# Altium schematic sheet Gas_leakage.SchDoc
size A; SheetNumber: 1; SheetTotal: 1
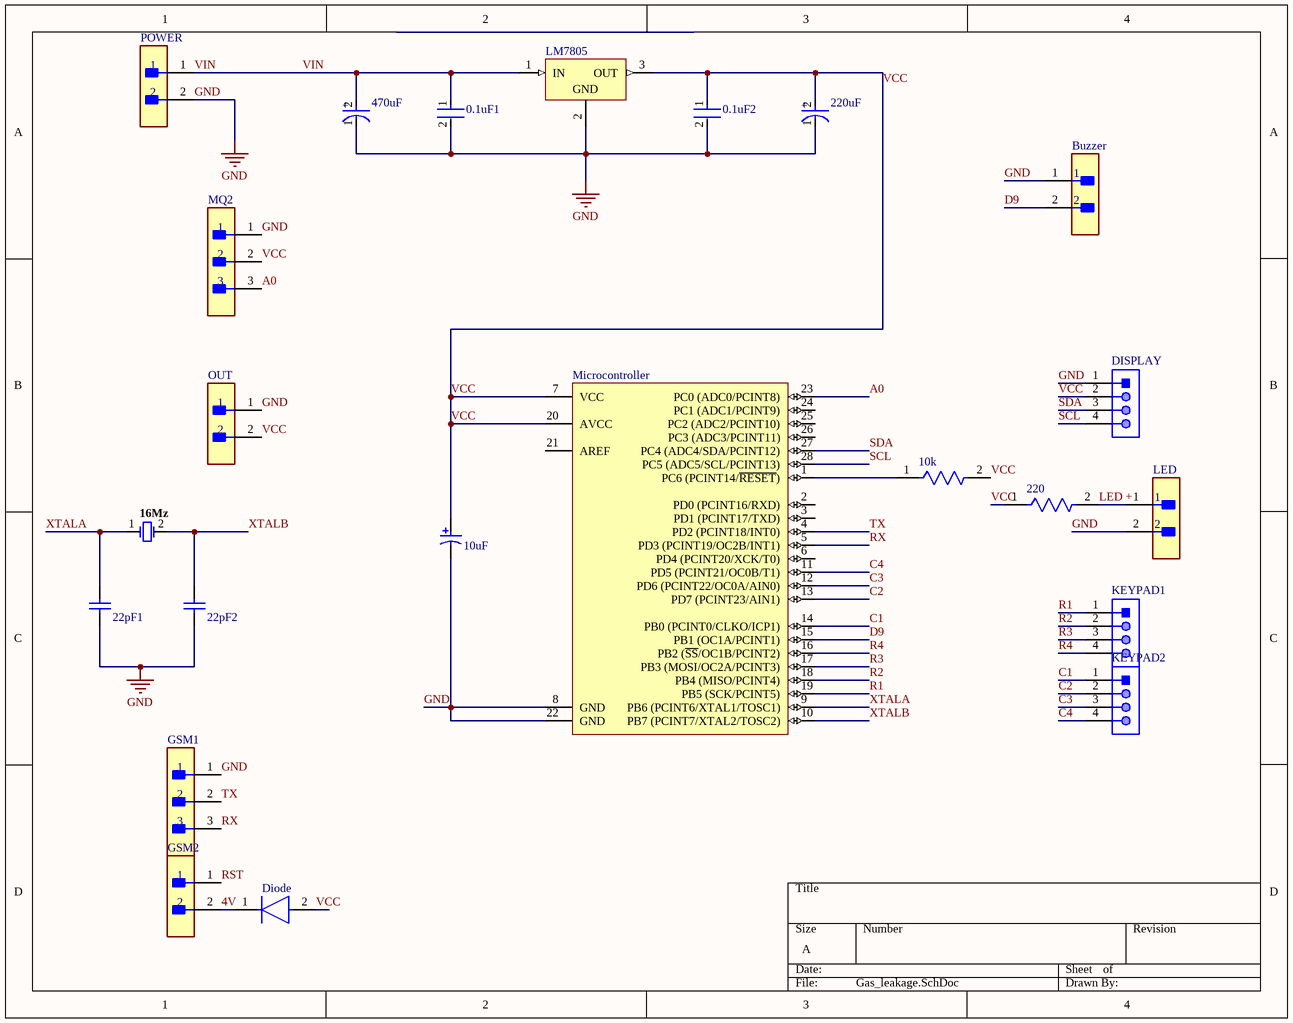
[diagram p0: Gas_leakage.SchDoc]

## Parts
0.1uF1  SR205C104KAR  [FP-SR20-MFG]  (value not drawn)
0.1uF2  SR205C104KAR  [FP-SR20-MFG]  (value not drawn)
10k  CF18JT10K0  [FP-CF18-MFG]  (value not drawn)
10uF  ECA1HM100  [CAPPR55-200-1100X500X1200]  (value not drawn)
16Mz  FOXSLF/160-20  [FOX-FOXSLF160-20]  (value not drawn)
22pF1  C315C220K1G5TA  [KEMT-C315-THT-2]  (value not drawn)
22pF2  C315C220K1G5TA  [KEMT-C315-THT-2]  (value not drawn)
220  CMF55205R00FHEB  [FP-CMF55-MFG]  (value not drawn)
220uF  EEUFM1A221  [FP-RAD-TH-D_6_3_0_5-L_11-MFG]  (value not drawn)
470uF  EEUHD1E471  [FP-RAD-TH-D_10_0_5-L_12_5-MFG]  (value not drawn)
Buzzer  M20-9990246  [FP-M20-9990246-MFG]  (value not drawn)
Diode  1N5408G-T  [FP-DO-201AD-MFG]  (value not drawn)
DISPLAY  61300411121  [61300411121]  (value not drawn)
GSM1  90120-0763  [FP-90120-0763-MFG]  (value not drawn)
GSM2  M20-9990246  [FP-M20-9990246-MFG]  (value not drawn)
KEYPAD1  1300411121  [61300411121]  (value not drawn)
KEYPAD2  61300411121  [61300411121]  (value not drawn)
LED  M20-9990246  [FP-M20-9990246-MFG]  (value not drawn)
LM7805  LM7805CT  [FAIR-TO-220-3]  (value not drawn)
Microcontroller  ATmega328P-PU  [28P3]  (value not drawn)
MQ2  90120-0763  [FP-90120-0763-MFG]  (value not drawn)
OUT  M20-9990246  [FP-M20-9990246-MFG]  (value not drawn)
POWER  M20-9990246  [FP-M20-9990246-MFG]  (value not drawn)

## Nets
GND: 0.1uF1.2 0.1uF2.2 10uF.2 22pF1.1 22pF2.1 220uF.1(C) 470uF.1(C) Buzzer.1 DISPLAY.1 GSM1.1 LED.2 LM7805.2(GND) Microcontroller.8(GND) Microcontroller.22(GND) MQ2.1 OUT.1 POWER.2
4V: Diode.1(C) GSM2.2
A0: Microcontroller.23(PC0_(ADC0/PCINT8)) MQ2.3
C1: KEYPAD2.1 Microcontroller.14(PB0_(PCINT0/CLKO/ICP1))
C2: KEYPAD2.2 Microcontroller.13(PD7_(PCINT23/AIN1))
C3: KEYPAD2.3 Microcontroller.12(PD6_(PCINT22/OC0A/AIN0))
C4: KEYPAD2.4 Microcontroller.11(PD5_(PCINT21/OC0B/T1))
D9: Buzzer.2 Microcontroller.15(PB1_(OC1A/PCINT1))
LED +: 220.2 LED.1
R1: KEYPAD1.1 Microcontroller.19(PB5_(SCK/PCINT5))
R2: KEYPAD1.2 Microcontroller.18(PB4_(MISO/PCINT4))
R3: KEYPAD1.3 Microcontroller.17(PB3_(MOSI/OC2A/PCINT3))
R4: KEYPAD1.4 Microcontroller.16(PB2_(~{SS}/OC1B/PCINT2))
RST: GSM2.1
RX: GSM1.3 Microcontroller.5(PD3_(PCINT19/OC2B/INT1))
SCL: DISPLAY.4 Microcontroller.28(PC5_(ADC5/SCL/PCINT13))
SDA: DISPLAY.3 Microcontroller.27(PC4_(ADC4/SDA/PCINT12))
TX: GSM1.2 Microcontroller.4(PD2_(PCINT18/INT0))
VCC: 0.1uF2.1 10k.2 10uF.1 220.1 220uF.2(A) Diode.2(A) DISPLAY.2 LM7805.3(OUT) Microcontroller.7(VCC) Microcontroller.20(AVCC) MQ2.2 OUT.2
VIN: 0.1uF1.1 470uF.2(A) LM7805.1(IN) POWER.1
XTALA: 16Mz.1 22pF1.2 Microcontroller.9(PB6_(PCINT6/XTAL1/TOSC1))
XTALB: 16Mz.2 22pF2.2 Microcontroller.10(PB7_(PCINT7/XTAL2/TOSC2))
Net10k_1: 10k.1 Microcontroller.1(PC6_(PCINT14/~{RESET}))

Not connected (* = marked no-connect by the designer): Microcontroller 2(PD0_(PCINT16/RXD)) 3(PD1_(PCINT17/TXD)) 6(PD4_(PCINT20/XCK/T0)) 21(AREF) 24(PC1_(ADC1/PCINT9)) 25(PC2_(ADC2/PCINT10)) 26(PC3_(ADC3/PCINT11))

## Notes on the sheet
- (in symbol CMP-05427-001329-1) +
- (in symbol CMP-05427-001388-1) +

## Library data of the parts
0.1uF1 0.1uF2 = CMP-04427-000013-1: CAP CER 0.1UF 50V X7R RADIAL; Manufacturer: AVX; Tolerance: 10%; Capacitance: 100nF; Value: 100nF; Voltage: 50V; Material: Ceramic; Height: 5.08mm; Digikey Description: CAP CER 0.1UF 50V X7R RADIAL; Device Class L2: Capacitors; ComponentLink2URL: http://datasheets.avx.com/SR-Series.pdf; Temperature Range High: +125°C; Lead Free: Yes; Manufacturer Part Number: SR205C104KAR; Category: Cap; Device Class L1: Passive Components; Temperature: -55°C to +125°C; Voltage Rating: 50V; ComponentLink2Description: Datasheet; RoHS: TRUE; Automotive: No; Octopart: https://octopart.com/sr205c104kar-avx-145048; Mouser Description: Multilayer Ceramic Capacitors MLCC - Leaded 50volts 0.1uF 10% X7R; Temperature Characteristic: X7R; Device Class L3: Ceramic Capacitors; Temperature Range Low: -55°C; Package: SR20
10k = CMP-26528-000002-1: RES 10K OHM 1/8W 5% CF AXIAL; Manufacturer: Stackpole Electronics; Power Rating: 0.125W; Temperature Coefficient: 0-500ppm/°C; Resistance: 10kΩ; Voltage Rating: 250V; Value: 10kΩ; Temperature: -55°C to +155°C; Height: 2mm; Lead Free: Yes; Automotive: No; Device Class L2: Resistors; Package: CF18; Series: CF; ComponentLink2Description: Datasheet; Ipc Land Pattern Name: RESAD656W65L360D200; Manufacturer Part Number: CF18JT10K0; Temperature Range High: +155°C; RoHS: TRUE; Device Class L3: Through-Hole Resistors; Temperature Range Low: -55°C; Device Class L1: Passive Components; Category: Res; Octopart: https://octopart.com/cf18jt10k0-stackpole+electronics-19205642; Composition: Carbon Film; Digikey Description: RES 10K OHM 1/8W 5% CF AXIAL; ComponentLink2URL: http://www.seielect.com/Catalog/SEI-CF_CFM.pdf; Tolerance: 5%
10uF = CMP-1665-00038-2: Aluminum Electrolytic Capacitor, 10 uF, +/- 20%, 50 V, -40 to 85 degC, 2-Pin THD, RoHS, Bulk; Manufacturer: Panasonic; Life (Hours): 2000Hour; Lead/Base Style: Straight; Dissipation Factor: 0.12%; Capacitance: 10uF; Leakage Current: 3uA; Dielectric Material: Aluminium; Lead Diameter: 0.5mm; Voltage Rating: 50V; Ripple Current: 65mA; Package Reference: CAPPR55-200-1100X500X1200; Height: 11mm; Diameter: 5mm; REACH SVHC: NoSVHC; Mount: ThroughHole; Packaging: Bulk; Manufacturer URL: http://www.panasonic.com/; Termination: Radial; Datasheet URL: https://industrial.panasonic.com/cdbs/www-data/pdf/RDF0000/ABA0000C1218.pdf; Lead Free: LeadFree; Height - Seated (Max): 0.472inch; Case/Package: Radial; Package Description: 2-Pin Radial Lead, Dia 5 mm, Height 12 mm; Tolerance: 20%; Datasheet Version: Rev. 05, 10/2016; Package Quantity: 200; Ripple Current (AC): 65mA; Min Operating Temperature: -40degC; RoHSCompliant: true; Number of Pins: 2; Max Operating Temperature: 85degC; Voltage: 50V; Lead Pitch: 2mm; Radiation Hardening: No; Voltage Rating (DC): 50V; Length: 11mm
16Mz = CMP-1749-00003-1: Resistance Weld Thru-Hole Crystal, 16 MHz, -20 to 70 degC, 2-Pin THD, RoHS, Bulk; Voltage Rating: 250 V; Tolerance: 1%; Resistance: 221 kohm; Case\Package: Axial; Power Rating: 250 mW; RoHSCompliant: true; Package Quantity: 200; Packaging: Bulk; Min Operating Temperature: -55 degC; DatasheetVersion: Mar-15; ComponentLink1URL: http://www.foxonline.com/; Max Operating Temperature: 155 degC; PackageReference: FOXSLF160-20; Mount: Through Hole; PackageDescription: 2-Pin Through Hole Device, Body 11.35 x 4.65 mm; ComponentLink1Description: Manufacturer URL; ComponentLink2URL: http://www.foxonline.com/pdfs/hc49slf.pdf; ComponentLink2Description: Datasheet; Length: 0.248 inch
22pF1 22pF2 = CMP-1664-00008-1: Capacitor, Ceramic, 22 pF, +/-10 %, 100 V, -55 to 125 degC, 2-Pin THD, RoHS, Bulk; Max Input Voltage: 40 V; Min Input Voltage: 4.2 V; Output Current: 1.5 A; Output Voltage: 1.2 V; Outputs: 1; Case\Package: TO-220; RoHSCompliant: true; Min Operating Temperature: 0 degC; Max Operating Temperature: 125 degC; Package Quantity: 50; ComponentLink2URL: http://capacitoredge.kemet.com/capedge2/DataSheet/Datasheet-C315C220K1G5TA.pdf?pn=C315C220K1G5TA{BULK}; Radiation Hardening: No; Pins: 3; Length: 10.28 mm; ComponentLink1URL: http://www.kemet.com/; ComponentLink2Description: Datasheet; Height: 9.28 mm; REACH SVHC: No SVHC; ComponentLink1Description: Manufacturer URL; Max Ouput Current: 1.5 A; Weight: 0.08113 oz; Packaging: Rail/Tube; DatasheetVersion: Aug-16; Mount: Through Hole; PackageReference: C315-THT-2; Width: 4.82 mm; PackageDescription: 2-Pin Through Hole Device, Body 3.81 x 2.54 mm
220 = CMP-02408-000020-1: RES 220 OHM 1/2W 1% AXIAL; Voltage Rating (DC): 250V; Max Power Dissipation: 500mW; Temperature Coefficient: 50ppm/°C; Resistance: 220; Diameter: 2.29mm; Package Quantity: 1; Length: 6.1mm; Max Operating Temperature: 175°C; Tolerance: 1%; Radiation Hardening: No; Features: Moisture Resistant; Width: 2.29mm; Mount: Through Hole; Case/Package: Axial; Min Operating Temperature: -55°C; Contact Plating: Tin; Number of Terminations: 2; RoHS Compliant: Yes; Resistor Type: Metal Film; Series: CMF; Lead Free: Lead Free; Packaging: Tape and Reel
220uF = CMP-05427-001329-1: Aluminum Electrolytic Capacitors (Radial Lead Type) 220uF ±20% 10V; Ripple Current: 455mA; Dielectric Material: Aluminium; Leakage Current: 10nA; Life (Hours): 2000Hour; Impedance: 130mR; Dissipation Factor: 0.19%; Lead Diameter: 0.5mm; Lead Length: 17mm; Outside Diameter: 6mm; Contact Plating: Tin; Lead Pitch: 2.5mm; Voltage: 10V; Max Operating Temperature: 105°C; Termination: Radial; Mount: Through Hole; Height: 11.2mm; RoHS Compliant: Yes; Voltage Rating (DC): 10V; Number of Pins: 2; Case/Package: Radial; Diameter: 6mm; ESR (Equivalent Series Resistance): 130mR; Construction: RADIAL; Lead Free: Lead Free; Min Operating Temperature: -40°C; Height - Seated (Max): 0.5inch; Capacitance: 220uF; Radiation Hardening: No; Voltage Rating: 10V; Length: 11mm; Ripple Current (AC): 455mA; Package Quantity: 200; Packaging: Bulk; Tolerance: 20%; Series: FM
470uF = CMP-05427-001388-1: Aluminum Electrolytic Capacitors (Radial Lead Type) AEC-Q200 Qualified 470uF ±20% 25V; Ripple Current (AC): 380mA; Lead/Base Style: Straight; Life (Hours): 2000Hour; Lead Diameter: 0.6mm; ESR (Equivalent Series Resistance): 600mR; Min Operating Temperature: -55°C; Height: 12.5mm; Voltage Rating: 25V; Termination: Radial; Voltage Rating (DC): 25V; Capacitance: 470uF; Lead Pitch: 5mm; Packaging: Bulk; Series: HD; Number of Pins: 2; REACH SVHC: No SVHC; Ripple Current: 380mA; Height - Seated (Max): 0.551inch; Max Operating Temperature: 105°C; Tolerance: 20%; Radiation Hardening: No; Voltage: 25V; RoHS Compliant: Yes; Mount: Through Hole; Package Quantity: 200; Lead Free: Lead Free; Construction: RADIAL; Case/Package: Radial; Diameter: 10mm; Length: 12.5mm
Buzzer GSM2 LED OUT POWER = CMP-15831-000009-1: CONN HEADER VERT 2POS 2.54MM; Manufacturer: Harwin; Conn Gender: Male; Conn Orientation: Vertical; Number Of Contacts: 2; Current Rating: 3A; ComponentLink2URL: https://cdn.harwin.com/pdfs/M20-999.pdf; ComponentLink2Description: Datasheet; Package: M20-9990246; Temperature: -40°C to +105°C; Octopart: https://octopart.com/m20-9990246-harwin-2590635; Mouser Description: 2.54mm (0.1") Pitch SIL Vertical PC Tail Pin Header, 6.1mm mating pin height, tin, 2 contacts; Temperature Range High: +105°C; Device Class L1: Connectors; RoHS: TRUE; Automotive: No; Height: 8.99mm; Number Of Rows: 1; Contact Material: Tin,Nickel; Category: Conn; Pitch: 2.54mm; Lead Free: Yes; Digikey Description: CONN HEADER VERT 2POS 2.54MM; Manufacturer Part Number: M20-9990246; Temperature Range Low: -40°C; Device Class L3: unset; Device Class L2: Headers and Wire Housings
Diode = CMP-12791-000058-1: DIODE GEN PURP 1KV 3A DO201AD; Element Configuration: Single; Polarity: Standard; Max Reverse Current: 5uA; Reverse Recovery Time: 2us; Max Surge Current: 125A; Forward Voltage: 1.1V; Capacitance: 40pF; Series: -; Average Rectified Current: 3A; Weight: 0.038801oz; Package Quantity: 1200; RoHS Compliant: Yes; Radiation Hardening: No; Mount: Through Hole; Forward Current: 3A; Length: 9.5mm; Min Operating Temperature: -65°C; Height: 5.3mm; Voltage Rating (DC): 1kV; Number of Pins: 2; Lead Free: Lead Free; Reverse Voltage (DC): 1kV; Output Current: 3A; Max Repetitive Reverse Voltage (Vrrm): 1kV; Case/Package: DO-201AD; Peak Non-Repetitive Surge Current: 125A; Current Rating: 3A; Packaging: Tape and Reel; Max Operating Temperature: 150°C; Recovery Time: 2us; Width: 5.3mm; Max Reverse Voltage (DC): 1kV
DISPLAY KEYPAD1 KEYPAD2 = CMP-1502-01064-1: THT Vertical Pin Header WR-PHD, Pitch 2.54 mm, Single Row, 4 pins; Manufacturer: Wurth Elektronik; Withstanding Voltage: 500VAC; Rated Current: 3A; Working Voltage: 250VAC; Pin Number: 4; Gender: Male; Contact Resistance: 20mOhm; Pitch: 2.54mm; Manufacturer URL: http://www.we-online.de; Operating Temperature: -40to105degC; Packaging: Bag; Mounting Technology: THT; Package Reference: 61300411121; Datasheet URL: https://katalog.we-online.de/em/datasheet/6130xx11121.pdf; Publisher: WurthElektronik; Part Number: 61300411121; Row Number: Single; Orientation: Vertical
GSM1 MQ2 = CMP-04776-000084-1: CONN HEADER VERT 3POS 2.54MM; Manufacturer: Molex; Voltage Rating: 350V; Number Of Contacts: 3; Conn Orientation: Vertical; Current Rating: 3A; Conn Gender: Male; Package: 90120-0763; ComponentLink2Description: Datasheet; Height: 5.8mm; Manufacturer Part Number: 90120-0763; Temperature Range High: +125°C; RoHS: TRUE; ComponentLink2URL: https://www.molex.com/webdocs/datasheets/pdf/en-us/0901200763_PCB_HEADERS.pdf; Device Class L2: Headers and Wire Housings; Temperature: -55°C to +125°C; Device Class L1: Connectors; Pitch: 2.54mm; Footprint Url: https://www.molex.com/pdm_docs/sd/901200763_sd.pdf; Device Class L3: unset; Temperature Range Low: -55°C; Number Of Rows: 1; Category: Conn; Lead Free: Yes; Mouser Description: Board-To-Board Connector, C-Grid III 90120 Series, Through Hole, Header, 3, 2.54 mm; Octopart: https://octopart.com/90120-0763-molex-655433; Contact Material: Gold,Nickel; Automotive: No; Digikey Description: CONN HEADER VERT 3POS 2.54MM
LM7805 = CMP-2000-04938-1: Positive Voltage Regulator, 5 V, 1 A, -40 to 125 degC, 3-Pin TO-220, RoHS, Tube; Manufacturer: FairchildSemiconductor; Maximum Input Voltage: 35V; Maximum Quiescent Current: 8mA; Load Regulation: 100mV; Maximum Output Current: 2.2(Typ)A; Output Type: Fixed; Typical Dropout Voltage @ Current: 2@1AV; Rad Hard: No; Output Voltage: 5V; Accuracy: ±4%; Number of Outputs: 1; Category: LinearRegulator; Package Description: 3-Pin Through Hole Device, Body 10 x 4.5 mm, Pitch 2.54 mm; Packaging: Rail/Tube; Mounting: ThroughHole; Polarity: Positive; Manufacturer URL: https://www.fairchildsemi.com/; Line Regulation: 100mV; Datasheet Version: Aug-12; Datasheet URL: https://datasheet.ciiva.com/26904/lm7805ct-26904988.pdf; Package Reference: TO-220; Package URL: https://www.fairchildsemi.com/package-drawings/TO/TO220B03.pdf; Package: 3TO-220AB; Operating Temperature: -40to125degC; Type: Linear
Microcontroller = CMP-0095-00013-2: 8-bit AVR Microcontroller, 32KB Flash, 1KB EEPROM, 2KB SRAM, 28-pin PDIP, Industrial Grade (-40°C to 85°C); RevisionNote: DatasheetVersion updated. URLs added.; PackageVersion: revB, Sep-2001; PackageDescription: 28-lead (0.300"/7.62mm Wide) Plastic Dual Inline Package (PDIP); DatasheetVersion: revD, May-2011; ComponentLink1Description: Manufacturer URL; ComponentLink1URL: http://www.atmel.com/; PackageReference: 28P3; ComponentLink2Description: ATmega48A/48PA/88A/88PA/168A/168PA/328/328P Datasheet; ComponentLink3URL: http://www.atmel.com/dyn/resources/prod_documents/8271S.pdf; ComponentLink2URL: http://www.atmel.com/dyn/resources/prod_documents/8271.pdf; ComponentLink3Description: ATmega48A/48PA/88A/88PA/168A/168PA/328/328P Summary; Supplier 1: Digi-Key; Supplier 2: Mouser